# EAGLE schematic ph_ControllerBase (EAGLE 6.1)
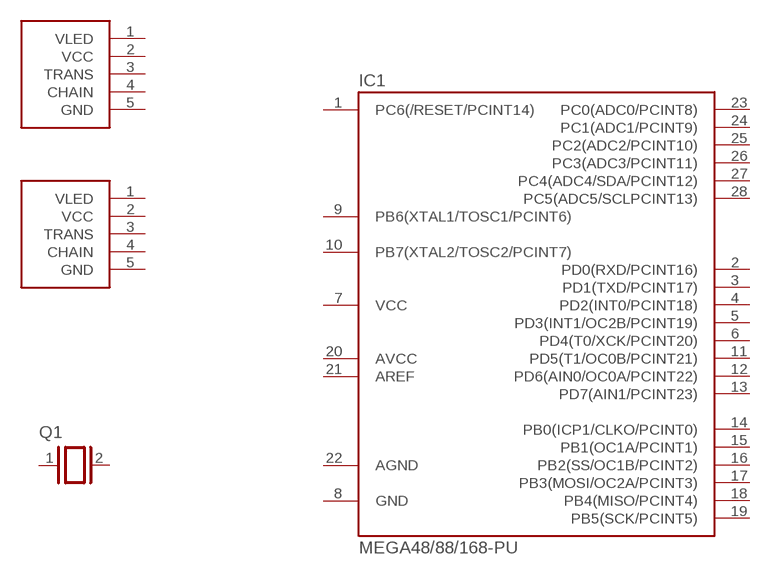
[diagram p0: schematic, sheet 1]

## Parts
IC1  MEGA48/88/168-PU  [DIL28-3]
Q1  XTAL/S  [QS]
SMD1  SERIAL_SENSORXH  [XH-5]
SMD2  SERIAL_SENSORXH  [XH-5]
Unconnected: IC1.1(PC6(/RESET/PCINT14)) IC1.2(PD0(RXD/PCINT16)) IC1.3(PD1(TXD/PCINT17)) IC1.4(PD2(INT0/PCINT18)) IC1.5(PD3(INT1/OC2B/PCINT19)) IC1.6(PD4(T0/XCK/PCINT20)) IC1.9(PB6(XTAL1/TOSC1/PCINT6)) IC1.10(PB7(XTAL2/TOSC2/PCINT7)) IC1.11(PD5(T1/OC0B/PCINT21)) IC1.12(PD6(AIN0/OC0A/PCINT22)) IC1.13(PD7(AIN1/PCINT23)) IC1.14(PB0(ICP1/CLKO/PCINT0)) IC1.15(PB1(OC1A/PCINT1)) IC1.16(PB2(SS/OC1B/PCINT2)) IC1.17(PB3(MOSI/OC2A/PCINT3)) IC1.18(PB4(MISO/PCINT4)) IC1.19(PB5(SCK/PCINT5)) IC1.20(AVCC) IC1.21(AREF) IC1.23(PC0(ADC0/PCINT8)) IC1.24(PC1(ADC1/PCINT9)) IC1.25(PC2(ADC2/PCINT10)) IC1.26(PC3(ADC3/PCINT11)) IC1.27(PC4(ADC4/SDA/PCINT12)) IC1.28(PC5(ADC5/SCLPCINT13)) Q1.1 Q1.2 SMD1.1(VLED) SMD1.2(VCC) SMD1.3(TRANS) SMD1.4(CHAIN) SMD1.5(GND) SMD2.1(VLED) SMD2.2(VCC) SMD2.3(TRANS) SMD2.4(CHAIN) SMD2.5(GND)

## Power pins joined to a net without a drawn wire
AGND: IC1.22(AGND)
GND: IC1.8(GND)
VCC: IC1.7(VCC)

## Library data of the parts
IC1 = avr-7:MEGA48/88/168-PU
Q1 = special:XTAL/S: CRYSTAL
SMD1 SMD2 = myparts:SERIAL_SENSOR